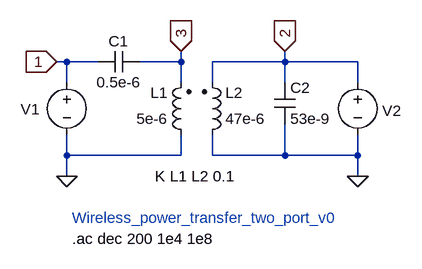
[diagram p0: schematic Wireless_power_transfer_two_port_v0.asc]
Wireless_power_transfer_two_port_v0.asc, the LTspice schematic file:
Version 4
SHEET 1 880 680
WIRE 96 0 80 0
WIRE 144 0 96 0
WIRE 272 0 272 -16
WIRE 272 0 208 0
WIRE 432 0 432 -16
WIRE 432 0 320 0
WIRE 544 0 432 0
WIRE 96 32 96 0
WIRE 272 32 272 0
WIRE 320 32 320 0
WIRE 432 32 432 0
WIRE 544 32 544 0
WIRE 96 144 96 112
WIRE 272 144 272 112
WIRE 272 144 96 144
WIRE 320 144 320 112
WIRE 432 144 432 96
WIRE 432 144 320 144
WIRE 544 144 544 112
WIRE 544 144 432 144
WIRE 96 176 96 144
WIRE 544 176 544 144
FLAG 96 176 0
FLAG 544 176 0
FLAG 80 0 1
IOPIN 80 0 In
FLAG 272 -16 3
IOPIN 272 -16 In
FLAG 432 -16 2
IOPIN 432 -16 In
SYMBOL voltage 96 16 R0
WINDOW 39 0 0 Left 0
WINDOW 0 -71 57 Left 2
WINDOW 3 24 96 Invisible 2
SYMATTR InstName V1
SYMATTR Value 1
SYMATTR Value2 AC 1
SYMBOL cap 208 -16 R90
WINDOW 0 0 32 VBottom 2
WINDOW 3 32 32 VTop 2
SYMATTR InstName C1
SYMATTR Value 0.5e-6
SYMBOL cap 416 32 R0
SYMATTR InstName C2
SYMATTR Value 53e-9
SYMBOL ind2 288 128 R180
WINDOW 0 36 80 Left 2
WINDOW 3 36 40 Left 2
SYMATTR InstName L1
SYMATTR Value 5e-6
SYMATTR Type ind
SYMATTR SpiceLine Rser=0
SYMBOL ind2 304 128 M180
WINDOW 0 36 80 Left 2
WINDOW 3 36 40 Left 2
SYMATTR InstName L2
SYMATTR Value 47e-6
SYMATTR Type ind
SYMATTR SpiceLine Rser=0
SYMBOL voltage 544 16 R0
WINDOW 0 38 59 Left 2
WINDOW 3 24 96 Invisible 2
SYMATTR InstName V2
SYMATTR Value 1
TEXT 232 176 Left 2 !K L1 L2 0.1
TEXT 104 272 Left 2 !.ac dec 200 1e4 1e8
TEXT 104 240 Left 2 ;Wireless_power_transfer_two_port_v0

The netlist it stands for:
* Wireless_power_transfer_two_port_v0.asc
V1 1 0 1 AC 1
C1 3 1 0.5e-6
C2 2 0 53e-9
L1 0 3 5e-6 Rser=0
L2 0 2 47e-6 Rser=0
V2 2 0 1
K L1 L2 0.1
.ac dec 200 1e4 1e8
* Wireless_power_transfer_two_port_v0
.backanno
.end